# Altium schematic sheet Main.SchDoc
size A4; SheetNumber: 1; SheetTotal: 4
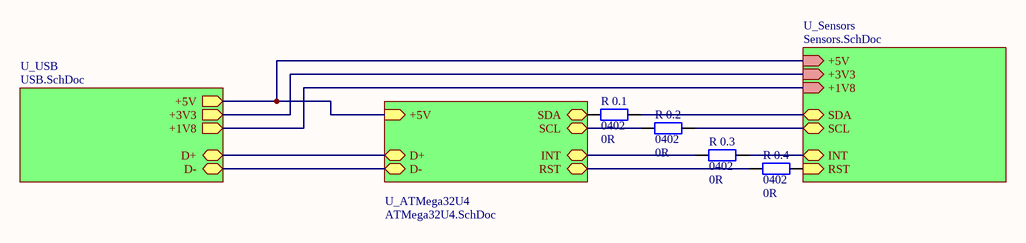
[diagram p0: Main.SchDoc]

## Parts
R_0.1  0402  value 0R  [R0402_M]
R_0.2  0402  value 0R  [R0402_M]
R_0.3  0402  value 0R  [R0402_M]
R_0.4  0402  value 0R  [R0402_M]

## Sub-sheets
U_ATMega32U4 = ATMega32U4.SchDoc: D+ (bidir), D- (bidir), SDA (bidir), SCL (bidir), INT (bidir), RST (bidir), +5V (in)
U_Sensors = Sensors.SchDoc: +1V8 (in), SDA (bidir), SCL (bidir), +3V3 (in), +5V (in), RST (in), INT (bidir)
U_USB = USB.SchDoc: D+ (bidir), D- (bidir), +1V8 (out), +3V3 (out), +5V (out)

## Nets
NetR_0.1_1: R_0.1.1 ; sheet U_ATMega32U4/SDA
NetR_0.1_2: R_0.1.2 ; sheet U_Sensors/SDA
NetR_0.2_1: R_0.2.1 ; sheet U_ATMega32U4/SCL
NetR_0.2_2: R_0.2.2 ; sheet U_Sensors/SCL
NetR_0.3_1: R_0.3.1 ; sheet U_ATMega32U4/INT
NetR_0.3_2: R_0.3.2 ; sheet U_Sensors/INT
NetR_0.4_1: R_0.4.1 ; sheet U_ATMega32U4/RST
NetR_0.4_2: R_0.4.2 ; sheet U_Sensors/RST
(unnamed): sheet U_USB/D+, sheet U_ATMega32U4/D+
(unnamed): sheet U_USB/D-, sheet U_ATMega32U4/D-
(unnamed): sheet U_USB/+1V8, sheet U_Sensors/+1V8
(unnamed): sheet U_USB/+3V3, sheet U_Sensors/+3V3
(unnamed): sheet U_USB/+5V, sheet U_ATMega32U4/+5V, sheet U_Sensors/+5V

## Library data of the parts
R_0.1-R_0.4 = R0402_1%_0R: Resistor; Manufactor: Multicomp; ManufactorPartNumber: MC00625W040210R; Tech: Dickschicht; VoltageRating: 50V; PowerRating: 0,0625W; Tolerance: 1%; Part Number: R0402_1%_0R; Type: Resistor; Supplier 1: Farnell; Supplier Part Number 1: 1357983